# EasyEDA Pro project BaseBoard.epro

# Schematic Schematic1
Board Name: Board1; Create Date: 2025-06-30; Page Name: P1; Project Name: 推力矢量四轴机架; Schematic Name: Schematic1; Update Date: 2025-07-06; Company: 嘉立创EDA; Page Size: A4; Version: V1.0
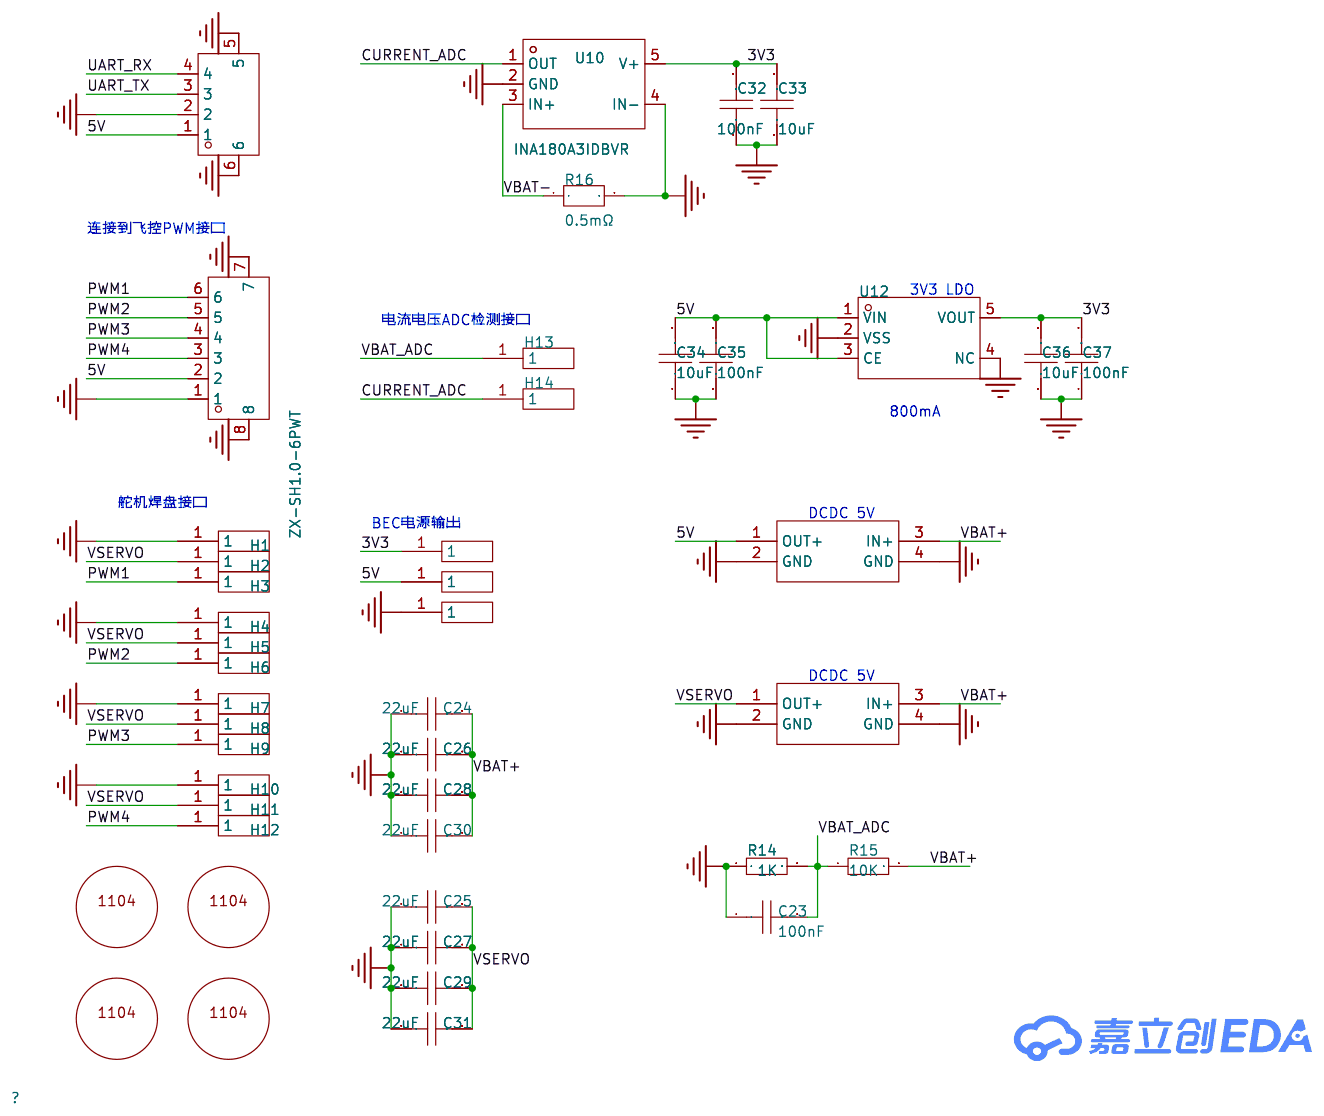
[diagram p0: schematic sheet]

## Parts
C23  100nF  [C0603]
C24  22uF  [C0805]
C25  22uF  [C0805]
C26  22uF  [C0805]
C27  22uF  [C0805]
C28  22uF  [C0805]
C29  22uF  [C0805]
C30  22uF  [C0805]
C31  22uF  [C0805]
C32  100nF  [C0603]
C33  10uF  [C0603]
C34  10uF  [C0603]
C35  100nF  [C0603]
C36  10uF  [C0603]
C37  100nF  [C0603]
H1  -  [飞控微型焊盘]
H2  -  [飞控微型焊盘]
H3  -  [飞控微型焊盘]
H4  -  [飞控微型焊盘]
H5  -  [飞控微型焊盘]
H6  -  [飞控微型焊盘]
H7  -  [飞控微型焊盘]
H8  -  [飞控微型焊盘]
H9  -  [飞控微型焊盘]
H10  -  [飞控微型焊盘]
H11  -  [飞控微型焊盘]
H12  -  [飞控微型焊盘]
H13  -  [飞控微型焊盘]
H14  -  [飞控微型焊盘]
H15  -  [飞控微型焊盘]
H17  -  [飞控微型焊盘]
H18  -  [飞控微型焊盘]
R14  1K  [R0603]
R15  10K  [R0603]
R16  0.5mΩ  [R2512]
U4  -  [1104无刷电机]
U5  -  [1104无刷电机]
U6  -  [1104无刷电机]
U7  -  [1104无刷电机]
U8  ZX-SH1.0-4PWT  [CONN-SMD_4P-P1.00_MEGASTAR_ZX-SH1.0-4PWT]
U10  INA180A3IDBVR  [SOT-23-5_L3.0-W1.7-P0.95-LS2.8-BR]
U11  ZX-SH1.0-6PWT  [CONN-SMD_6P-P1.00_MEGASTAR_ZX-SH1.0-6PWT]
U12  ME6217C33M5G  [SOT-23-5_L3.0-W1.7-P0.95-LS2.8-BR]
U13  -  [迷你降压模块]
U14  -  [迷你降压模块]

## Library data of the parts
C23 C32-C37 = CAP_0603: Supplier Footprint: 0603
C24-C31 = CAP_0805: Supplier Footprint: 0805
H1-H15 H17 H18 = 飞控微型焊盘: 20250513 绘制接收机使用
R14 R15 = Res_0603: Supplier Footprint: 0603
R16 = HoYLR2512E-3W-0.5mR-1%: 电阻类型:采样电阻;阻值:0.5mΩ;精度:±1%;功率:3W;安装方式:贴片;; LCSC Part Name: 0.5mΩ ±1% 3W; Supplier Part: C5375456; Manufacturer: Milliohm(毫欧); Supplier Footprint: 2512; JLCPCB Part Class: 扩展库; Supplier: LCSC; Type: 采样电阻; Tolerance: ±1%; Power(Watts): 3W; Mounting Sytle: 贴片
U4-U7 = 1104无刷电机
U8 = ZX-SH1.0-4PWT: 插针结构:1x4P;间距:1mm;安装方式:卧贴;参考系列:SH;总PIN数:4P;排数:1;每排PIN数:4;行距:-;额定电流:-;触头材质:黄铜;触头镀层:锡;工作温度范围:-;; LCSC Part Name: 1x4P 间距:1mm 卧贴 系列:SH; Supplier Part: C7430446; Manufacturer: Megastar(兆星); Supplier Footprint: SMD,P=1mm,卧贴; JLCPCB Part Class: 扩展库; Datasheet: https://atta.szlcsc.com/upload/public/pdf/source/20230619/390816C24B7A0EB1D042395C380CEA99.pdf; Supplier: LCSC; Pins Structure: 1x4P; Pitch: 1mm; Mounting Style: 卧贴; Reference Series: SH; Number of Pins: 4P; Number of Rows: 1; Number of PINs Per Row: 4; Contact Material: 黄铜; Contact Plating: 锡; Supplementary Features: 辅助焊脚; Colour: 米色; Z-Height of the Board: 3.15mm; X-Length of Bottom Edge on Board (Spacing Line): 6.35mm; Y-Width of Bottom Edge on Board: 5.05mm
U10 = INA180A3IDBVR: 放大器数:单路;共模电压:-200mV~26V;增益:100V/V;带宽:150kHz;; Supplier Part: C122882; Manufacturer: TI(德州仪器); Supplier Footprint: SOT-23-5; JLCPCB Part Class: 扩展库; Datasheet: https://www.ti.com/cn/lit/gpn/ina180; Supplier: LCSC; Number of Channels: 单路; Vcm - Common Mode Voltage: -200mV~26V; Gain: 100V/V; Bandwidth: 150kHz; Voltage - Supply: 2.7V~5.5V; Operating Temperature: -40℃~+125℃
U11 = ZX-SH1.0-6PWT: 插针结构:1x6P;间距:1mm;安装方式:卧贴;参考系列:SH;总PIN数:6P;排数:1;每排PIN数:6;行距:-;额定电流:-;触头材质:黄铜;触头镀层:锡;工作温度范围:-;; LCSC Part Name: 1x6P 间距:1mm 卧贴 系列:SH; Supplier Part: C7430448; Manufacturer: Megastar(兆星); Supplier Footprint: SMD,P=1mm,卧贴; JLCPCB Part Class: 扩展库; Datasheet: https://atta.szlcsc.com/upload/public/pdf/source/20230619/677B156B919545DC550B043554513491.pdf; Supplier: LCSC; Pins Structure: 1x6P; Pitch: 1mm; Mounting Style: 卧贴; Reference Series: SH; Number of Pins: 6P; Number of Rows: 1; Number of PINs Per Row: 6; Contact Material: 黄铜; Contact Plating: 锡; Supplementary Features: 辅助焊脚; Colour: 米色; Z-Height of the Board: 3.15mm; X-Length of Bottom Edge on Board (Spacing Line): 8.35mm; Y-Width of Bottom Edge on Board: 5.05mm
U12 = ME6217C33M5G: 输出类型:固定;输出极性:正;最大输入电压:7V;输出电压:3.3V;输出电流:800mA;电源纹波抑制比(PSRR):65dB@(1kHz);; Supplier Part: C427602; Manufacturer: MICRONE(南京微盟); Supplier Footprint: SOT-23-5; JLCPCB Part Class: 扩展库; Datasheet: https://atta.szlcsc.com/upload/public/pdf/source/20190910/C427602_D4B9162A2E9D9EF57C60010DFDECEF37.pdf; Supplier: LCSC; Output Type: 固定; Output Polarity: 正; Number of Outputs: 1; Maximum Input Voltage: 7V; Output Voltage: 3.3V; Dropout Voltage: 180mV@(300mA); Output Current: 800mA; Power Supply Rejection Ratio (PSRR): 65dB@(1kHz)
U13 U14 = 迷你DCDC降压模块: 20250630 DCDC 5V

## Nets
3V3: C32.2 C33.2 C36.2 C37.2 H15.1 U10.5(V+) U12.5(VOUT)
5V: C34.2 C35.2 H17.1 U8.1 U11.2 U12.1(VIN) U12.3(CE) U13.1(OUT+)
GND: C23.1 C24.1 C25.1 C26.1 C27.1 C28.1 C29.1 C30.1 C31.1 C32.1 C33.1 C34.1 C35.1 C36.1 C37.1 H1.1 H4.1 H7.1 H10.1 H18.1 R14.1 R16.2 U8.2 U8.5 U8.6 U10.2(GND) U10.4(IN-) U11.1 U11.7 U11.8 U12.2(VSS) U12.4(NC) U13.2(GND) U13.4(GND) U14.2(GND) U14.4(GND)
VBAT+: C24.2 C26.2 C28.2 C30.2 R15.2 U13.3(IN+) U14.3(IN+)
VBAT-: R16.1 U10.3(IN+)
VBAT_ADC: C23.2 H13.1 R14.2 R15.1
CURRENT_ADC: H14.1 U10.1(OUT)
PWM1: H3.1 U11.6
PWM2: H6.1 U11.5
PWM3: H9.1 U11.4
PWM4: H12.1 U11.3
UART_RX: U8.4
UART_TX: U8.3
VSERVO: C25.2 C27.2 C29.2 C31.2 H2.1 H5.1 H8.1 H11.1 U14.1(OUT+)

## Notes on the sheet
- 连接到飞控PWM接口
- 3V3 LDO
- 电流电压ADC检测接口
- 800mA
- 舵机焊盘接口
- DCDC 5V
- BEC电源输出
- DCDC 5V

# Board PCB1
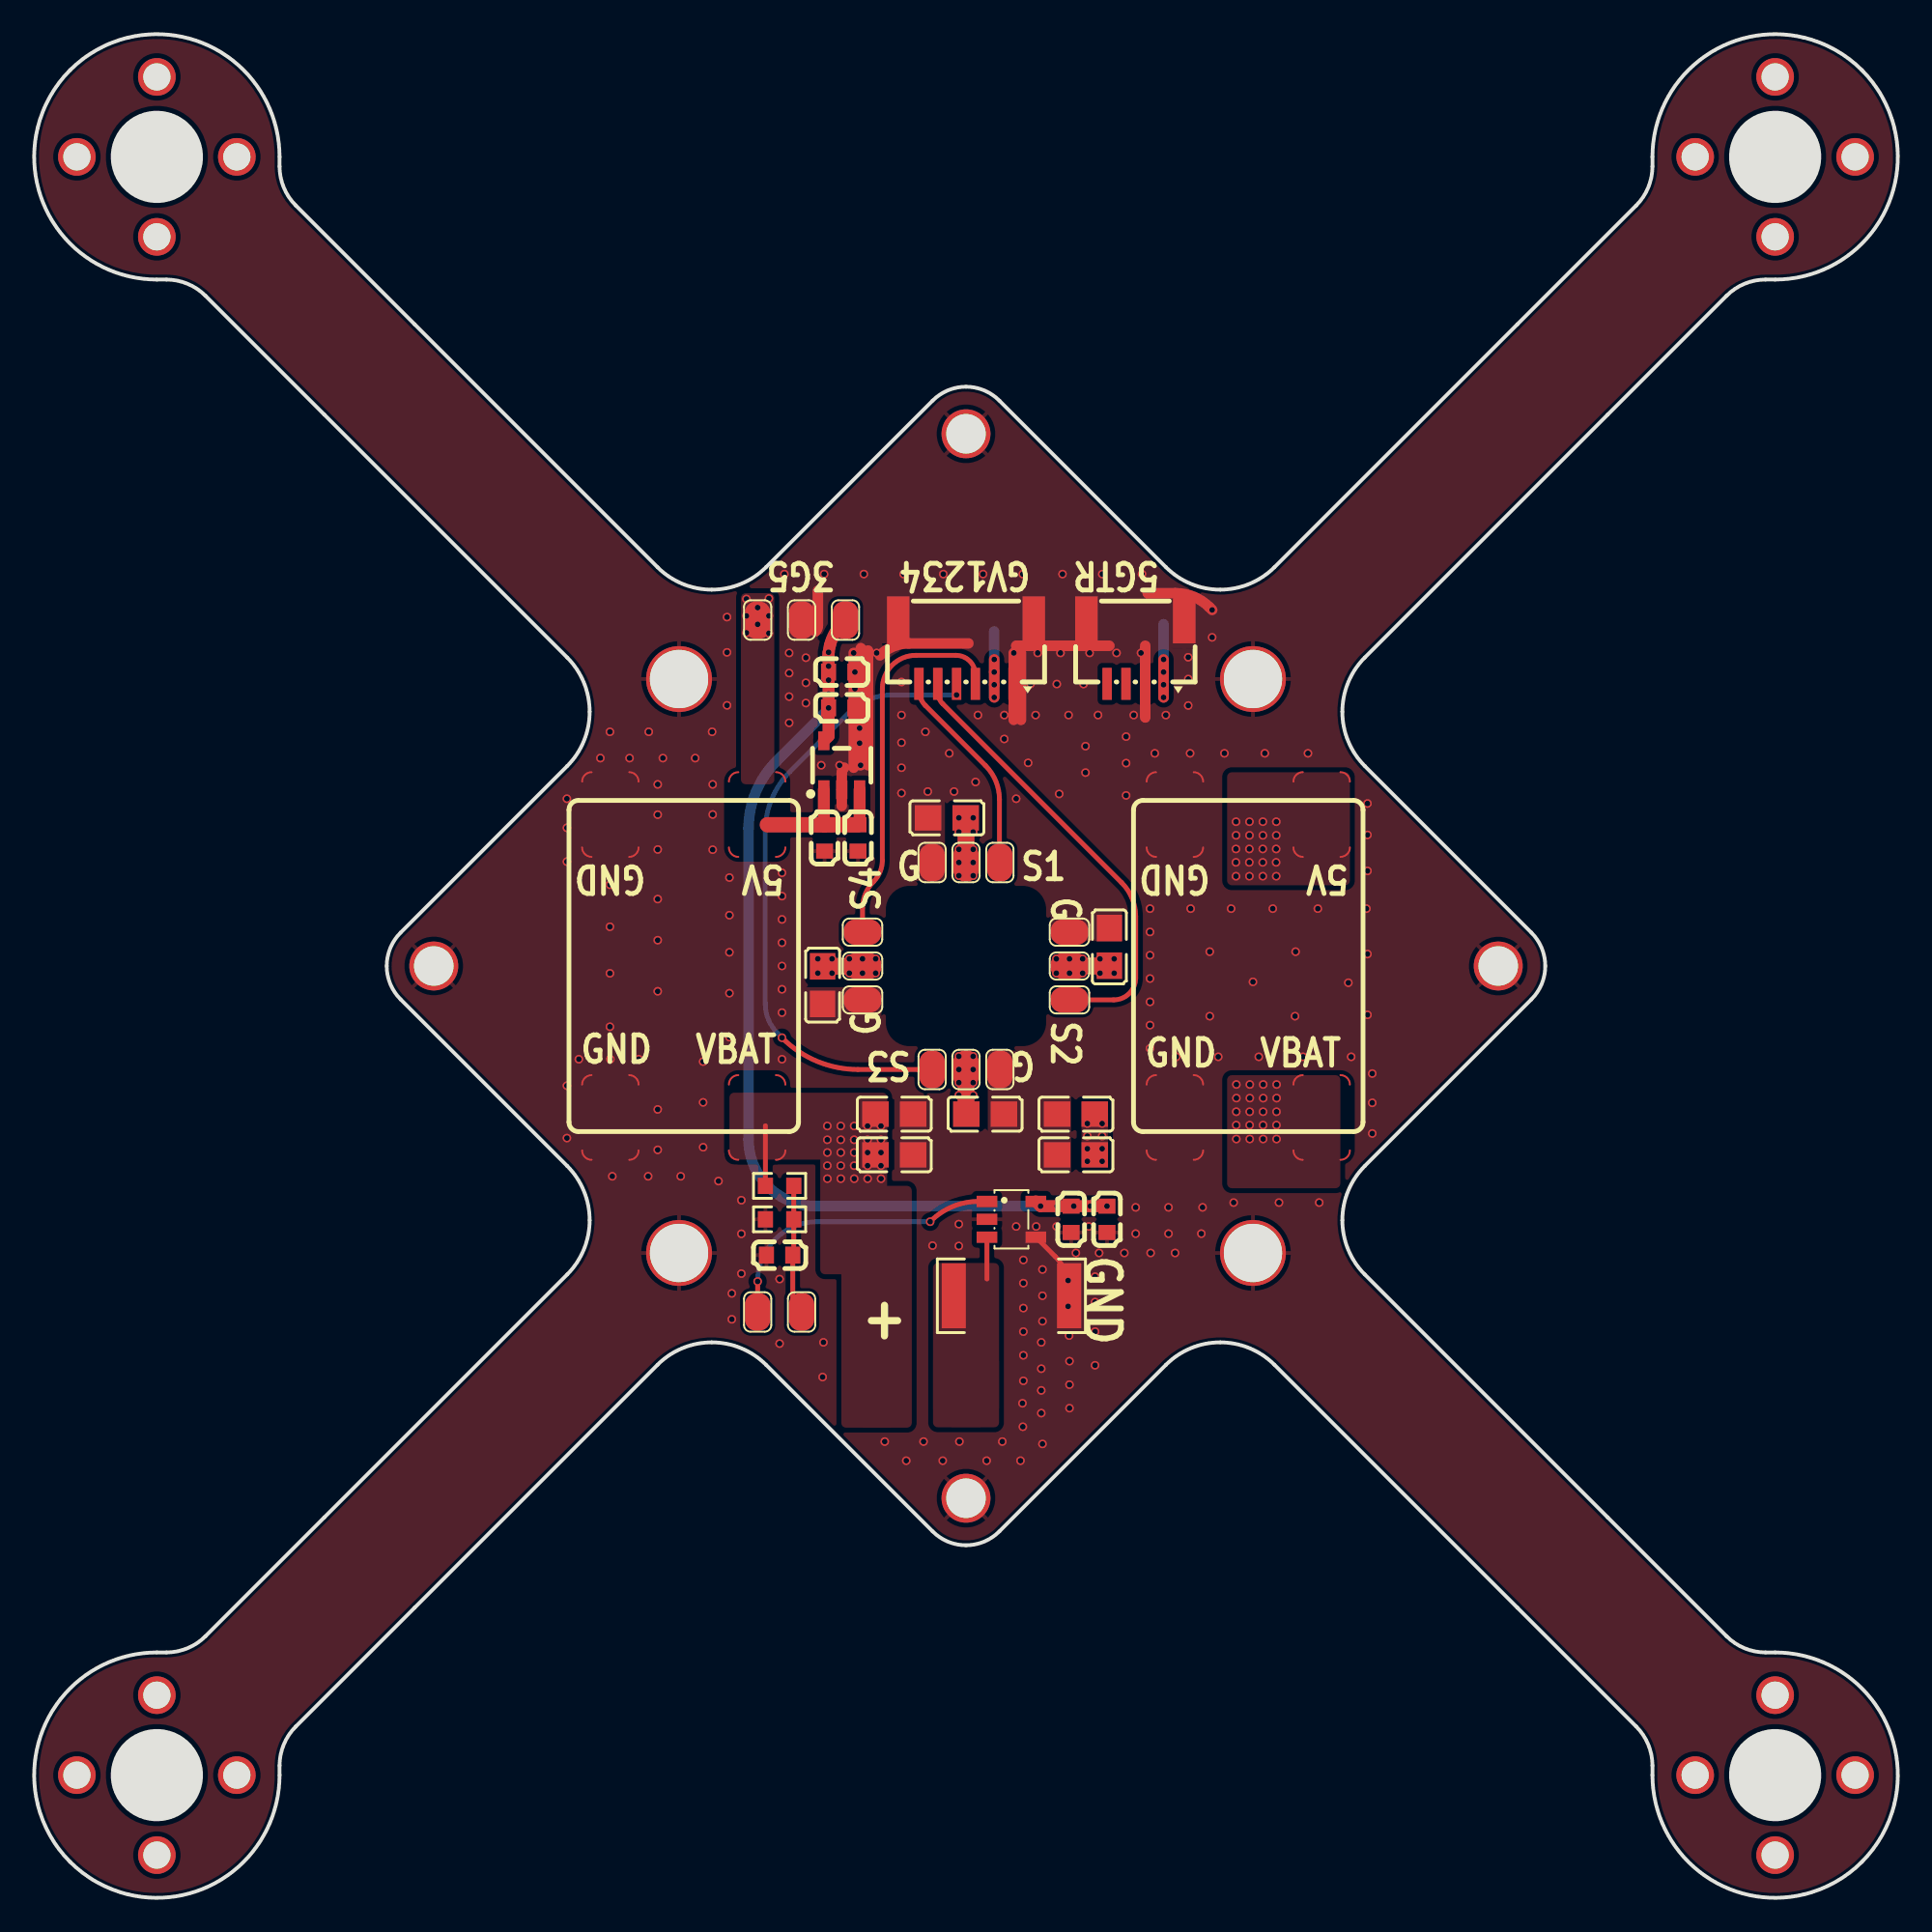
[diagram p1: board, top side]
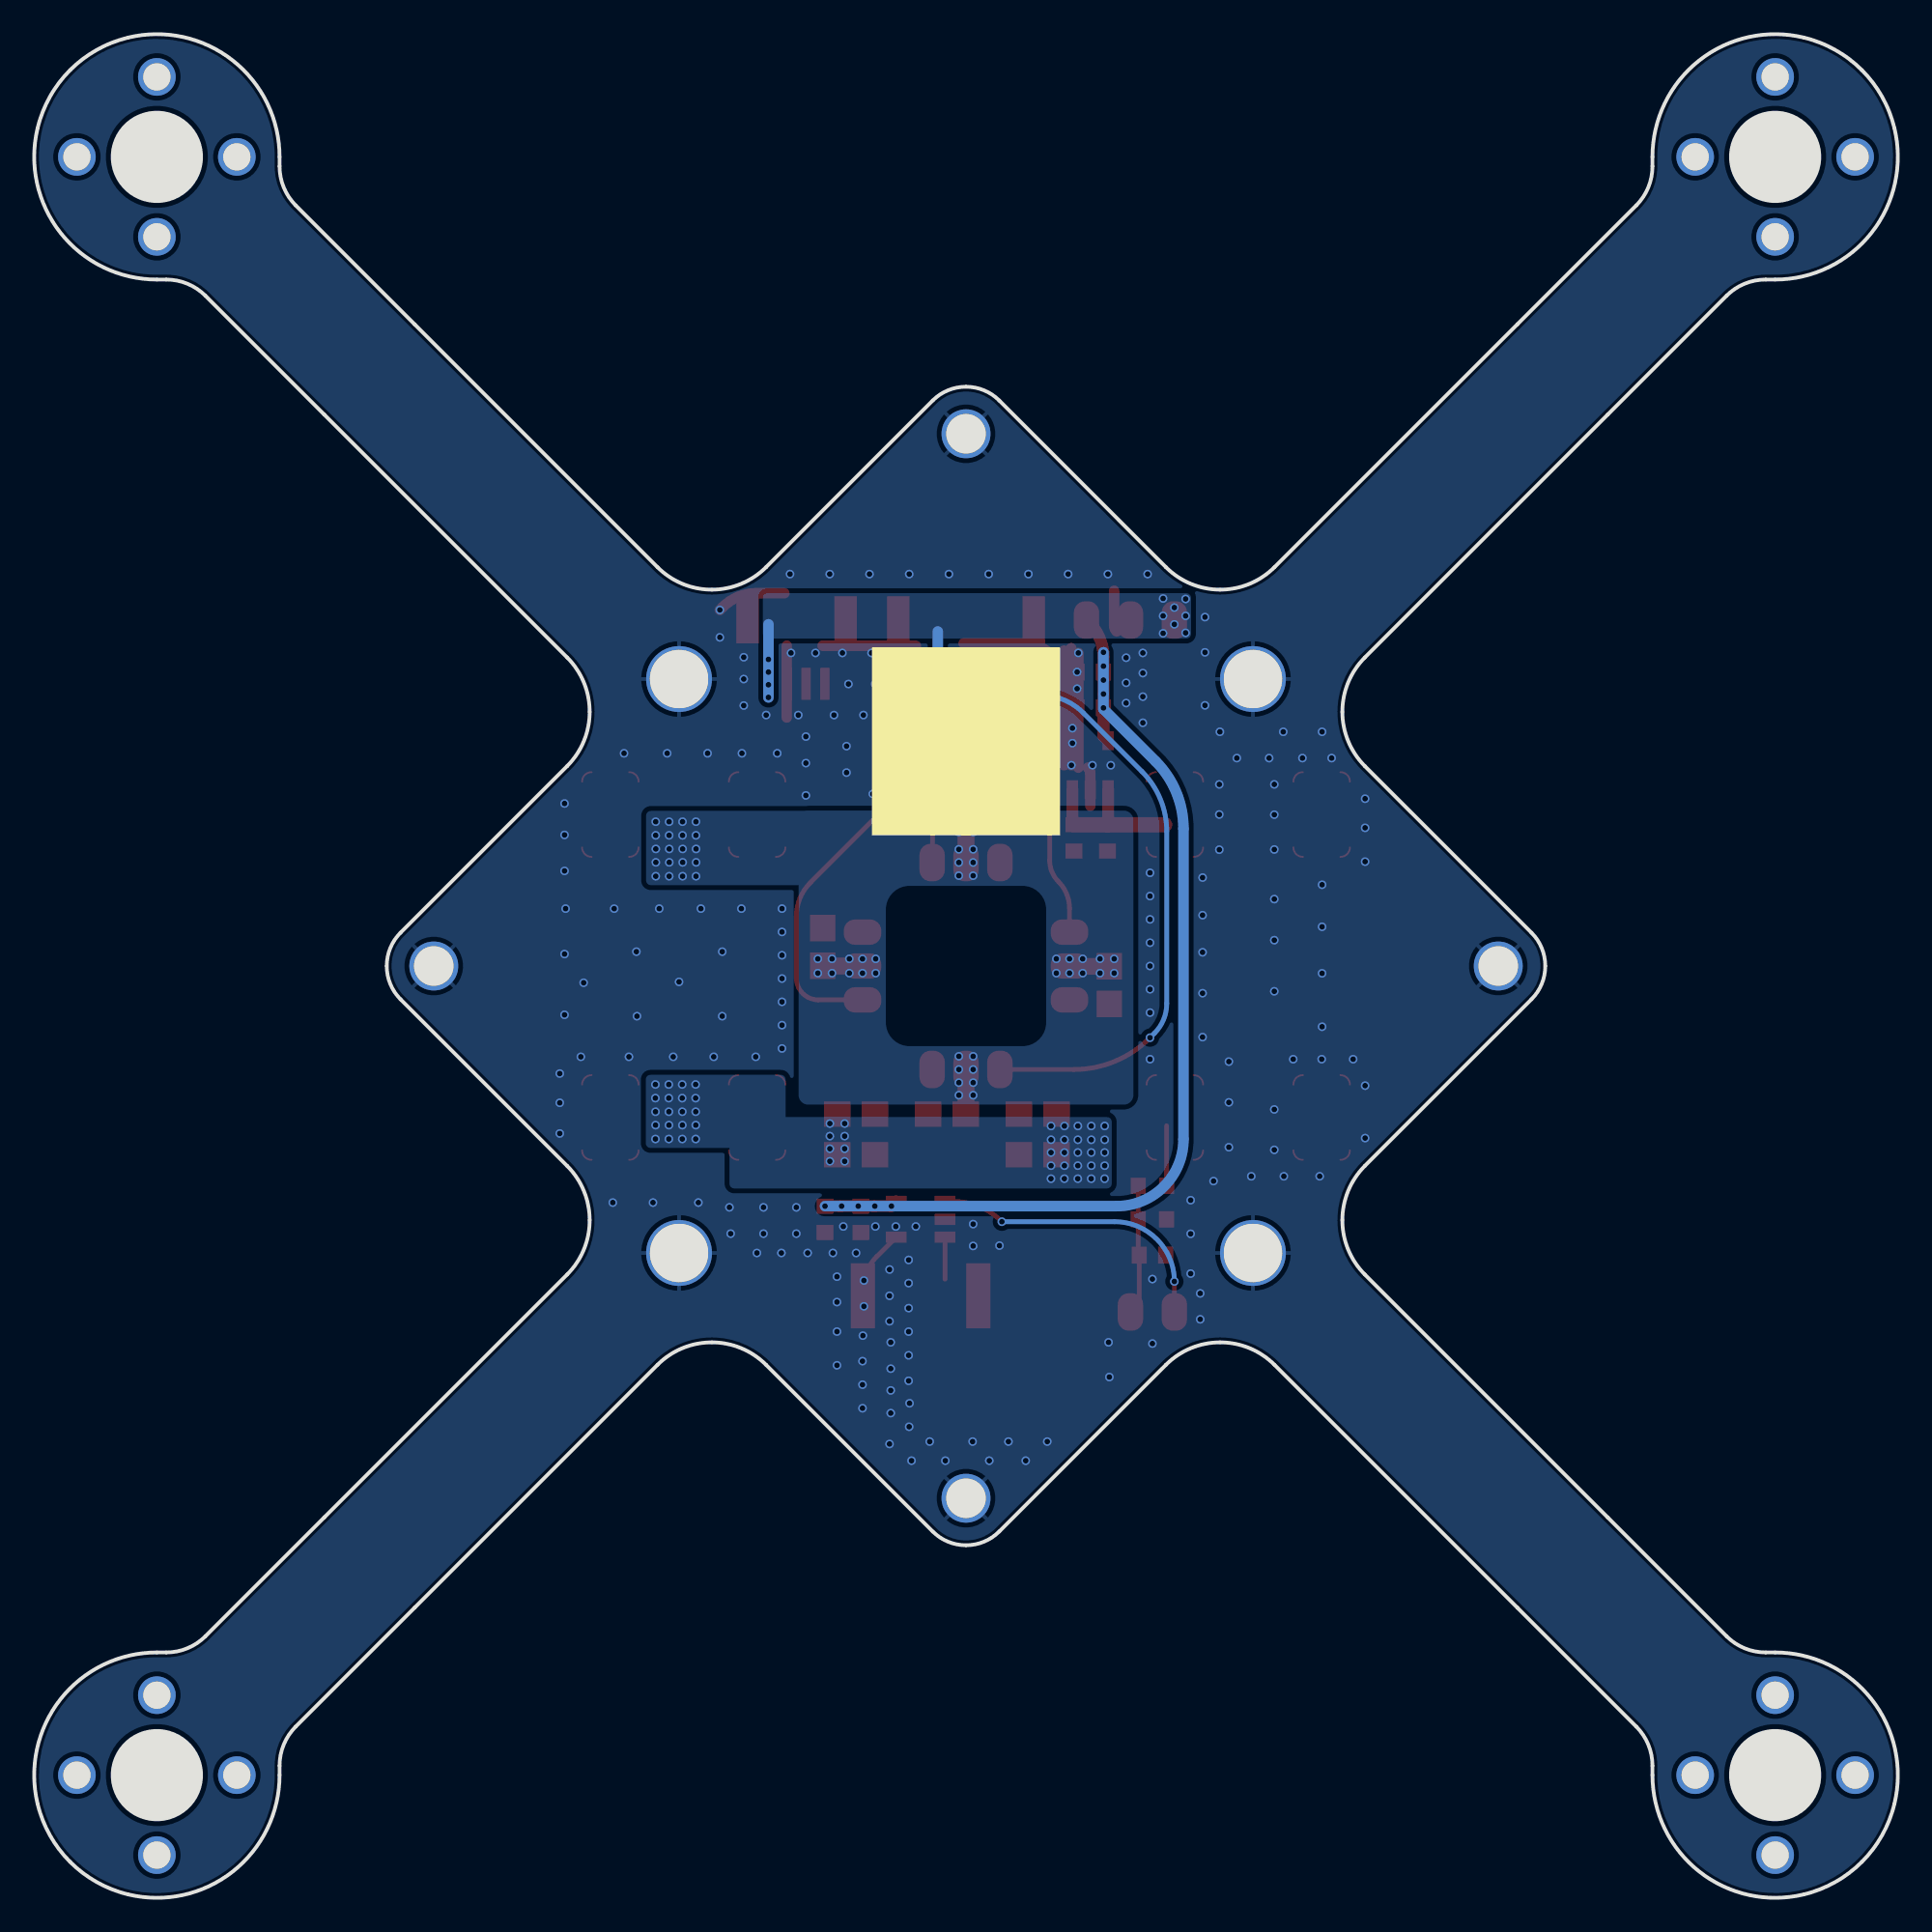
[diagram p2: board, bottom side, seen from below]

Outline 99.04 x 99.04 mm; copper layers: Top Layer, Bottom Layer. Coordinates in mm from the lower left corner of the outline.
Outline path: 0.18,94.06 arc(0.83,95.71) 1.91,97.13 arc(3.33,98.21) 4.98,98.86 arc(10.55,97.65) 13.04,92.52 13.04,92.02 arc(13.26,90.89) 13.9,89.94 33.13,70.72 arc(34.45,69.83) 36.01,69.52 arc(37.57,69.83) 38.9,70.72 47.75,79.57 arc(48.56,80.11) 49.52,80.3 arc(50.48,80.11) 51.29,79.57 60.14,70.72 arc(61.47,69.83) 63.03,69.52 arc(64.59,69.83) 65.92,70.72 85.14,89.94 arc(85.78,90.89) 86,92.02 86,92.52 arc(88.49,97.64) 94.06,98.86 arc(95.71,98.21) 97.13,97.13 arc(98.21,95.71) 98.86,94.06 arc(97.65,88.49) 92.52,86 92.02,86 arc(90.89,85.78) 89.94,85.14 70.72,65.92 arc(69.83,64.59) 69.52,63.03 arc(69.83,61.47) 70.72,60.14 79.57,51.29 arc(80.11,50.48) 80.3,49.52 arc(80.11,48.56) 79.57,47.75 70.72,38.9 arc(69.83,37.57) 69.52,36.01 arc(69.83,34.45) 70.72,33.13 89.94,13.9 arc(90.89,13.26) 92.02,13.04 92.52,13.04 arc(97.64,10.55) 98.86,4.98 arc(98.21,3.33) 97.13,1.91 arc(95.71,0.83) 94.06,0.18 arc(88.49,1.4) 86,6.52 86,7.02 arc(85.78,8.15) 85.14,9.1 65.92,28.33 arc(64.59,29.21) 63.03,29.52 arc(61.47,29.21) 60.14,28.33 51.29,19.47 arc(50.48,18.93) 49.52,18.74 arc(48.56,18.93) 47.75,19.47 38.9,28.33 arc(37.57,29.21) 36.01,29.52 arc(34.45,29.21) 33.13,28.33 13.9,9.1 arc(13.26,8.15) 13.04,7.02 13.04,6.52 arc(10.55,1.4) 4.98,0.18 arc(3.33,0.83) 1.91,1.91 arc(0.83,3.33) 0.18,4.98 arc(1.4,10.55) 6.52,13.04 7.02,13.04 arc(8.15,13.26) 9.1,13.9 28.33,33.13 arc(29.21,34.45) 29.52,36.01 arc(29.21,37.57) 28.33,38.9 19.47,47.75 arc(18.93,48.56) 18.74,49.52 arc(18.93,50.48) 19.47,51.29 28.33,60.14 arc(29.21,61.47) 29.52,63.03 arc(29.21,64.59) 28.33,65.92 9.1,85.14 arc(8.15,85.78) 7.02,86 6.52,86 arc(1.4,88.49) 0.18,94.06
Stack: Top Layer 0.035mm / Dielectric1 1.51mm FR4 er 4.5 / Bottom Layer 0.035mm

## Design rules (mm)
template: 自定义配置
spacing copperThickness1oz (default): track to track 0.102, other pairs 0.152 to 0.3
spacing copperThickness2oz: track to track 0.203, other pairs 0.152 to 0.3
track width copperThickness1oz (default): min 0.127, default 0.254, max 2.54
track width copperThickness2oz: min 0.203, default 0.254, max 2.54
differential pair differentialPair (default): width min 0.127, default 0.254, max 2.54; gap min 0.152, default 0.152
via viaSize (default): diameter min 0.254, default 0.457, max 10; hole min 0.3, default 0.305, max 6.299

## Placement (name value [footprint] x y rotation side)
C23  100nF  [C0603]  39.61 34.15 0 top
C24  22uF  [C0805]  45.71 39.49 180 top
C25  22uF  [C0805]  57.14 50.54 270 top
C26  22uF  [C0805]  45.71 41.65 180 top
C27  22uF  [C0805]  50.54 41.65 180 top
C28  22uF  [C0805]  55.36 41.65 0 top
C29  22uF  [C0805]  41.9 48.5 90 top
C30  22uF  [C0805]  55.36 39.49 0 top
C31  22uF  [C0805]  48.5 57.39 0 top
C32  100nF  [C0603]  55.11 36.06 90 top
C33  10uF  [C0603]  57.01 36.06 90 top
C34  10uF  [C0603]  43.78 56.33 90 top
C35  100nF  [C0603]  42 56.33 90 top
C36  10uF  [C0603]  42.92 65.14 180 top
C37  100nF  [C0603]  42.92 63.24 180 top
H1  -  [飞控微型焊盘]  47.72 55.02 90 top
H2  -  [飞控微型焊盘]  49.52 55.02 90 top
H3  -  [飞控微型焊盘]  51.32 55.02 90 top
H4  -  [飞控微型焊盘]  55.02 51.32 0 top
H5  -  [飞控微型焊盘]  55.02 49.52 0 top
H6  -  [飞控微型焊盘]  55.02 47.72 0 top
H7  -  [飞控微型焊盘]  51.32 44.02 270 top
H8  -  [飞控微型焊盘]  49.52 44.02 270 top
H9  -  [飞控微型焊盘]  47.72 44.02 270 top
H10  -  [飞控微型焊盘]  44.02 47.72 180 top
H11  -  [飞控微型焊盘]  44.02 49.52 180 top
H12  -  [飞控微型焊盘]  44.02 51.32 180 top
H13  -  [飞控微型焊盘]  40.78 31.14 90 top
H14  -  [飞控微型焊盘]  38.45 31.14 90 top
H15  -  [飞控微型焊盘]  43.12 67.91 90 top
H17  -  [飞控微型焊盘]  38.45 67.91 90 top
H18  -  [飞控微型焊盘]  40.78 67.91 90 top
NOREF  -  [Pad_e37]  21.23 49.52 45 top
NOREF#2  -  [Pad_e41]  49.52 21.23 45 top
NOREF#3  -  [Pad_e169]  64.77 64.77 0 top
NOREF#4  -  [Pad_e166]  34.27 64.77 0 top
NOREF#5  -  [Pad_e40]  77.8 49.52 45 top
NOREF#6  -  [Pad_e39]  49.52 77.8 45 top
NOREF#7  -  [Pad_e171]  34.27 34.27 0 top
NOREF#8  -  [Pad_e170]  64.77 34.27 0 top
R14  1K  [R0603]  39.61 36.06 0 top
R15  10K  [R0603]  39.61 37.84 180 top
R16  0.5mΩ  [R2512]  51.93 31.99 0 top
U4  -  [1104无刷电机]  6.52 92.52 45 top
U5  -  [1104无刷电机]  92.52 92.52 45 top
U6  -  [1104无刷电机]  6.52 6.52 45 top
U7  -  [1104无刷电机]  92.52 6.52 45 top
U8  ZX-SH1.0-4PWT  [CONN-SMD_4P-P1.00_MEGASTAR_ZX-SH1.0-4PWT]  58.52 66.22 180 top
U10  INA180A3IDBVR  [SOT-23-5_L3.0-W1.7-P0.95-LS2.8-BR]  51.93 36.06 180 top
U11  ZX-SH1.0-6PWT  [CONN-SMD_6P-P1.00_MEGASTAR_ZX-SH1.0-6PWT]  49.52 66.22 180 top
U12  ME6217C33M5G  [SOT-23-5_L3.0-W1.7-P0.95-LS2.8-BR#2]  42.92 60.19 270 top
U13  -  [迷你降压模块]  34.52 49.52 270 top
U14  -  [迷你降压模块]  64.52 49.52 270 top
U15  -  [JLC-QRCODE-10x10]  49.52 61.46 180 bottom

## Footprints (pads in the part's own frame, mm; a bottom-side part is the same pattern mirrored in y, then rotated)
1104无刷电机
  round 2 hole 1.45: 1(-3.005,3.005) 2(3.005,3.005) 3(3.005,-3.005) 4(-3.005,-3.005)
C0603
  rect 0.8x0.9 smd: 1(-0.7,0) 2(0.7,0)
C0805
  rect 1.41x1.35 smd: 1(-1,0) 2(1,0)
CONN-SMD_4P-P1.00_MEGASTAR_ZX-SH1.0-4PWT
  rect 0.5x1.7 smd: 1(-1.5,1.7) 2(-0.5,1.7) 3(0.5,1.7) 4(1.5,1.7)
  rect 1.2x2.5 smd: 5(2.6,-1.7) 6(-2.6,-1.7)
CONN-SMD_6P-P1.00_MEGASTAR_ZX-SH1.0-6PWT
  rect 0.5x1.7 smd: 1(-2.5,1.7) 2(-1.5,1.7) 3(-0.5,1.7) 4(0.5,1.7) 5(1.5,1.7) 6(2.5,1.7)
  rect 1.2x2.5 smd: 7(3.6,-1.7) 8(-3.6,-1.7)
Pad_e37
  round 2.6 hole 2.1: 1(0,0)
Pad_e39
  round 2.6 hole 2.1: 1(0,0)
Pad_e40
  round 2.6 hole 2.1: 1(0,0)
Pad_e41
  round 2.6 hole 2.1: 1(0,0)
Pad_e166
  round 3.5 hole 3.1: 1(0,0)
Pad_e169
  round 3.5 hole 3.1: 1(0,0)
Pad_e170
  round 3.5 hole 3.1: 1(0,0)
Pad_e171
  round 3.5 hole 3.1: 1(0,0)
R0603
  rect 0.806x0.864 smd: 1(-0.753,0) 2(0.753,0)
R2512
  rect 1.282x3.456 smd: 1(-3.067,0) 2(3.067,0)
SOT-23-5_L3.0-W1.7-P0.95-LS2.8-BR
  rect 1.1x0.6 smd: 1(1.3,-0.95) 2(1.3,0) 3(1.3,0.95) 4(-1.3,0.95) 5(-1.3,-0.95)
SOT-23-5_L3.0-W1.7-P0.95-LS2.8-BR#2
  rect 1x0.6 smd: 1(1.3,-0.95) 2(1.3,0) 3(1.3,0.95) 4(-1.3,0.95) 5(-1.3,-0.95)
迷你降压模块
  custom 4.5x3 smd: 1(-8.05,3.9) 2(-8.05,-3.9) 3(8.05,3.9) 4(8.05,-3.9)
飞控微型焊盘
  rrect 2x1.35 smd: 1(0,0)

## Nets
As in the schematic, except:
GND: C23.1 C24.1 C25.1 C26.1 C27.1 C28.1 C29.1 C30.1 C31.1 C32.1 C33.1 C34.1 C35.1 C36.1 C37.1 H1.1 H4.1 H7.1 H10.1 H18.1 NOREF.1 NOREF#2.1 NOREF#3.1 NOREF#4.1 NOREF#5.1 NOREF#6.1 NOREF#7.1 NOREF#8.1 R14.1 R16.2 U8.2 U8.5 U8.6 U10.2 U10.4 U11.1 U11.7 U11.8 U12.2 U12.4 U13.2 U13.4 U14.2 U14.4

Pads without a net: U4 1 2 3 4; U5 1 2 3 4; U6 1 2 3 4; U7 1 2 3 4

## Via types
v1: diameter 0.457, hole 0.305, Top Layer to Bottom Layer, 360 vias

## Routing (per net, layer and track width the routed paths; a pad name or vN(x,y) marks a point on that pad's centre or on a via; arc(x,y) is an arc through that point)
3V3: length 59.4
  Top Layer w0.635: v1(42.21,66.19) 42.21,65.95 ; 42.21,65.95 v1(42.21,65.45) v1(42.21,64.71) v1(42.21,63.23) 42.21,61.73 U12.5 ; 42.21,65.95 arc(42.22,66.07) 42.22,66.19 arc(42.25,66.36) 42.28,66.54 arc(42.54,67.19) 42.96,67.75 H15.1 ; 53.23,37 v1(53.48,36.75) C32.2 v1(57.01,36.75)
  Bottom Layer w0.559: v1(42.21,66.19) v1(42.21,65.45) v1(42.21,64.71) v1(42.21,63.97) 42.21,63.17 39.44,60.4 arc(38.35,58.75) 37.96,56.82 37.96,40.31 arc(39,37.8) 41.52,36.75 v1(53.48,36.75) v1(54.36,36.75) v1(55.24,36.75) v1(56.13,36.75) v1(57.01,36.75)
5V: length 20
  Top Layer w0.559: v1(51.02,65.81) v1(51.02,65.14) v1(51.02,64.46) v1(51.02,63.79) ; v1(60.02,63.79) v1(60.02,64.46) v1(60.02,65.14) v1(60.02,65.81)
  Top Layer w0.635: C35.2 41.96,57.06 U12.1 ; C34.2 43.86,57.11 U12.3
  Top Layer w0.813: C34.2 C35.2 38.96,57.02
  Bottom Layer w0.559: v1(60.02,63.79) v1(60.02,64.46) v1(60.02,65.14) v1(60.02,65.81) 60.02,67.68 ; 51.02,67.3 v1(51.02,65.81) v1(51.02,65.14) v1(51.02,64.46) v1(51.02,63.79)
  vias: v1(37.85,69.03) v1(37.85,68.13) v1(37.85,67.23) v1(38.45,68.57) v1(38.45,67.68) v1(39.05,69.05) v1(39.05,68.13) v1(39.05,67.2)
GND: length 50.8
  Top Layer w0.254: 53.23,35.11 54.26,34.09 arc(54.69,33.5) v1(54.95,32.81) arc(54.99,32.55) 55,32.29 R16.2
  Top Layer w0.559: 59.17,69.33 60.66,69.33 arc(61.63,69.14) 62.45,68.58 v1(62.6,68.44) ; 44.31,66.28 44.31,60.18 ; 41.64,69.46 41.64,67.6 arc(41.61,67.44) 41.52,67.3 ; 43.55,60.06 v1(43.55,66.15) ; 42.91,58.03 U12.2 42.91,59.75 arc(42.94,59.89) 43.01,60.02 arc(43.02,60.04) 43.04,60.06 ; 43.93,66.41 43.93,60.21 arc(43.93,60.2) v1(43.92,60.18) ; 49.64,66.66 46.48,66.66 arc(45.65,66.5) 44.94,66.03 ; 52.18,66.53 57.14,66.53 ; 59.04,66.53 59.04,62.72 ; v1(52.06,66.15) 52.06,62.6 ; 52.44,66.15 52.44,62.6
  vias: v1(28.31,58.41) v1(28.31,56.86) v1(28.31,55.07) v1(28.31,43.16) v1(28.31,40.38) v1(28.95,44.57) v1(30.09,60.57) v1(30.6,61.97) v1(30.6,53.84) v1(30.6,51.61) v1(30.6,49.13) v1(30.6,46.29) v1(30.62,44.57) v1(30.72,38.34) v1(31.64,60.57) v1(32.13,44.57) v1(32.66,61.97) v1(32.63,38.34) v1(33.14,59.17) v1(33.14,57.56) v1(33.14,55.71) v1(33.14,53.08) v1(33.14,50.89) v1(33.14,48.18) v1(33.14,41.9) v1(33.14,39.75) v1(33.41,60.57) v1(34.36,38.34) v1(35.13,60.57) v1(35.55,44.44) v1(35.55,42.27) v1(35.55,39.89) v1(36.03,61.97) v1(36.06,59.17) v1(36.06,57.57) v1(36.06,55.7) v1(36.37,38.09) v1(36.82,68.06) v1(36.82,66.19) v1(36.82,63.37) v1(36.95,54.22) v1(36.95,52.22) v1(36.95,50.25) v1(36.95,48.08) v1(36.95,45.74) v1(37.07,32.12) v1(37.07,30.74) v1(37.58,37.07) v1(37.58,35.29) v1(37.58,33.17) v1(39.61,32.88) v1(39.61,29.45) v1(39.74,54.47) v1(39.74,53.23) v1(39.74,52) v1(39.74,50.76) v1(39.74,49.52) v1(39.74,48.28) v1(39.74,47.04) v1(39.74,44.57) v1(39.87,70.35) v1(40.12,66.16) v1(40.12,65.09) v1(40.12,63.84) v1(40.12,62.45) v1(41.01,65.9) v1(41.01,64.57) v1(41.01,63.49) v1(41.83,60.19) v1(41.94,29.52) v1(41.9,27.68) v1(41.98,70.35) v1(42.8,60.19) v1(43.62,65.14) v1(43.62,64.26) v1(43.87,62.16) v1(43.87,61.36) v1(44.09,70.35) v1(44.77,66.16) v1(45.2,24.25) v1(46.09,64.62) v1(46.09,62.86) v1(46.09,61.39) v1(46.09,60.06) v1(46.09,58.71) v1(46.2,70.35) v1(46.35,23.23) v1(47.26,24.25) v1(47.36,61.97) v1(47.49,58.79) v1(47.74,34.66) v1(48.31,70.35) v1(48.28,23.23) v1(48.63,60.82) v1(48.89,58.79) v1(49.14,35.8) v1(49.14,34.64) v1(49.17,24.25) v1(50.03,59.3) v1(50.16,62.86) v1(50.43,70.35) v1(50.62,23.23) v1(51.45,24.25) v1(51.56,62.86) v1(51.55,61.59) v1(52.19,58.41) v1(52.19,35.68) v1(52.42,23.23) v1(52.54,70.35) v1(52.57,33.9) v1(52.57,32.67) v1(52.57,31.34) v1(52.57,30.09) v1(52.57,28.83) v1(52.57,27.48) v1(52.52,26.28) v1(52.54,25.03) v1(52.82,60.32) v1(52.95,64.51) v1(53.22,62.86) v1(53.25,35.68) v1(53.33,66.16) v1(53.52,29.52) v1(53.52,28.12) v1(53.52,26.97) v1(53.52,25.76) v1(53.58,33.39) v1(53.58,31.99) v1(53.58,30.64) v1(53.58,24.12) v1(54.35,64.51) v1(54.34,35.68) v1(54.54,66.16) v1(54.47,58.66) v1(54.65,70.35) v1(54.95,31.43) v1(54.97,62.86) v1(55,29.88) v1(55.02,28.52) v1(55.02,27.27) v1(55.02,26.02) v1(55.36,34.27) v1(55.77,64.51) v1(55.87,61.2) v1(55.87,59.8) v1(56.04,35.68) v1(56.09,66.16) v1(56.38,33.01) v1(56.38,31.66) v1(56.38,30.09) v1(56.38,28.3) v1(56.54,62.86) v1(56.59,34.27) v1(56.76,70.35) v1(57.52,66.16) v1(57.94,34.27) v1(58.03,61.71) v1(58.03,60.3) v1(58.03,58.59) v1(58.43,62.86) v1(58.54,36.69) v1(58.54,35.3) v1(58.82,66.16) v1(58.87,70.35) v1(59.3,52.57) v1(59.3,51.33) v1(59.3,50.09) v1(59.3,48.85) v1(59.3,47.61) v1(59.3,46.38) v1(59.3,45.14) v1(59.33,34.27) v1(59.55,60.82) v1(60.14,62.86) v1(60.28,36.69) v1(60.28,35.3) v1(60.63,34.27) v1(60.7,44.69) v1(61.33,65.93) v1(61.33,64.77) v1(61.33,63.36) v1(61.43,60.82) v1(61.46,52.57) v1(62.03,35.3) v1(62.09,36.69) v1(62.47,50.28) v1(62.47,46.85) v1(62.6,66.99) v1(62.93,44.69) v1(63.25,60.82) v1(63.61,52.57) v1(63.74,36.95) v1(64.77,48.68) v1(65.08,44.69) v1(65.4,60.82) v1(65.82,52.57) v1(66.15,36.95) v1(67.04,50.28) v1(67.01,46.85) v1(67.43,44.69) v1(67.69,60.82) v1(68.22,52.57) v1(68.29,36.95) v1(69.84,48.63) v1(69.99,44.69) v1(70.86,58.16) v1(70.86,56.49) v1(70.86,54.57) v1(70.8,52.57) v1(70.86,50.16) v1(70.86,46.93) v1(71.11,43.81) v1(71.11,42.25) v1(71.11,40.62)
VBAT+: length 3.2
  Top Layer w0.254: R15.2 38.86,41.03
  vias: v1(42.15,41.02) v1(42.15,40.29) v1(42.15,39.61) v1(42.15,38.91) v1(42.15,38.22) v1(42.86,41.02) v1(42.86,40.29) v1(42.86,39.61) v1(42.86,38.91) v1(42.87,38.22) v1(43.58,41.02) v1(43.58,40.29) v1(43.58,39.61) v1(43.58,38.91) v1(43.58,38.22) v1(44.29,41.02) v1(44.29,40.29) v1(44.29,39.61) v1(44.29,38.91) v1(44.29,38.22) v1(45,41.02) v1(45,40.29) v1(45,39.61) v1(45,38.91) v1(45.01,38.22) v1(55.97,41.15) v1(55.97,40.48) v1(55.97,39.81) v1(55.97,39.14) v1(56.76,41.15) v1(56.76,40.48) v1(56.76,39.81) v1(56.76,39.14) v1(63.89,43.22) v1(63.89,42.5) v1(63.88,41.78) v1(63.88,41.06) v1(63.89,40.33) v1(64.6,43.22) v1(64.6,42.5) v1(64.6,41.78) v1(64.59,41.06) v1(64.6,40.33) v1(65.32,43.22) v1(65.32,42.5) v1(65.31,41.78) v1(65.31,41.06) v1(65.31,40.33) v1(66.03,43.22) v1(66.03,42.5) v1(66.02,41.78) v1(66.02,41.06) v1(66.02,40.33)
VBAT-: length 2.2
  Top Layer w0.254: U10.3 50.63,32.88
VBAT_ADC: length 6.9
  Top Layer w0.254: H13.1 40.31,31.6 C23.2 40.36,34.2 R14.2 R15.1
CURRENT_ADC: length 15.9
  Top Layer w0.254: U10.1 50.17,37 arc(48.8,36.73) 47.64,35.95 v1(47.61,35.93) ; H14.1 v1(38.44,32.75)
  Bottom Layer w0.254: v1(47.62,35.93) 41.62,35.93 arc(39.38,35) v1(38.45,32.76)
PWM1: length 11.1
  Top Layer w0.254: 47.02,64.52 47.02,64.2 arc(47.11,63.74) 47.37,63.36 50.55,60.17 arc(51.1,59.35) 51.3,58.37 51.3,55.04 H3.1
PWM2: length 24
  Top Layer w0.254: H6.1 57.37,47.72 arc(58.19,48.06) 58.53,48.88 58.53,52.15 arc(58.34,53.12) 57.79,53.94 48.27,63.46 arc(48.08,63.74) 48.02,64.08 48.02,64.51
PWM3: length 33.6
  Top Layer w0.254: H9.1 43.78,44.02 arc(41.61,44.45) 39.76,45.68 v1(39.74,45.71)
  Bottom Layer w0.254: v1(39.74,45.71) 39.51,45.95 arc(39.02,46.67) 38.85,47.52 38.85,56.67 arc(39.2,58.4) 40.17,59.86 43.28,62.96 arc(44.34,63.67) 45.6,63.92 v1(49.02,63.92)
PWM4: length 20.2
  Top Layer w0.254: H12.1 44.02,52.58 arc(44.17,53.35) 44.6,54 arc(44.95,54.52) 45.07,55.13 45.07,64.25 arc(45.59,65.51) 46.85,66.03 48.98,66.03 arc(49.71,65.72) 50.02,64.99 50.02,64.51
VSERVO: length 9
  Top Layer w0.889: C27.2 49.52,41.66 H8.1 ; C25.2 57.12,49.52 H5.1 ; C29.2 44,49.5 H11.1 ; H2.1 49.52,57.37 C31.2
  vias: v1(41.65,49.9) v1(41.65,49.14) v1(42.4,49.9) v1(42.4,49.14) v1(43.32,49.9) v1(43.32,49.14) v1(44.02,49.9) v1(44.02,49.14) v1(44.72,49.9) v1(44.72,49.14) v1(49.14,57.39) v1(49.14,56.64) v1(49.14,55.72) v1(49.14,55.02) v1(49.14,54.32) v1(49.14,44.72) v1(49.14,44.02) v1(49.14,43.32) v1(49.14,42.65) v1(49.9,57.39) v1(49.9,56.64) v1(49.9,55.72) v1(49.9,55.02) v1(49.9,54.32) v1(49.9,44.72) v1(49.9,44.02) v1(49.9,43.32) v1(49.9,42.65) v1(54.32,49.9) v1(54.32,49.14) v1(55.02,49.9) v1(55.02,49.14) v1(55.72,49.9) v1(55.72,49.14) v1(56.64,49.9) v1(56.64,49.14) v1(57.39,49.9) v1(57.39,49.14) v1(63.87,55.74) v1(63.86,55.03) v1(63.87,54.29) v1(63.87,57.19) v1(63.87,56.46) v1(64.59,57.19) v1(64.59,56.46) v1(64.58,55.74) v1(64.58,55.03) v1(64.58,54.29) v1(65.3,57.19) v1(65.3,56.46) v1(65.29,55.74) v1(65.29,55.03) v1(65.29,54.29) v1(66.01,57.19) v1(66.01,56.46) v1(66,55.74) v1(66,55.03) v1(66.01,54.29)

## Copper pours and planes (outline as drawn; the poured copper is in the pictures)
5V on Top Layer: 37.56,69.34 39.34,69.34 39.34,59.18 37.56,59.18
5V on Bottom Layer: 37.56,69.34 60.32,69.34 60.32,66.92 37.56,66.92
GND on Top Layer: 28.82,40.63 33.14,40.63 33.14,38.73 28.82,38.73
GND on Top Layer: 28.42,45.27 33.14,45.27 33.14,39.61 28.42,39.61
GND on Top Layer: -7.12,106.04 106.8,106.04 106.8,-7.38 -7.12,-7.38
GND on Top Layer: 52.19,36.06 54.18,36.06 54.18,31.99 52.19,31.99
GND on Top Layer: 45.71,42.61 48.02,42.61 48.02,38.39 45.71,38.39
GND on Top Layer: 52.52,29.52 56.02,29.52 56.02,25.02 52.52,25.02
GND on Top Layer: 58.16,44.95 62.82,44.95 62.82,38.28 58.16,38.28
GND on Top Layer: 54.01,52.86 57.81,52.86 57.81,50.84 54.01,50.84
GND on Top Layer: 44.57,69.97 57.45,69.97 57.45,66.67 44.57,66.67
GND on Top Layer: 53.2,43.3 55.11,43.3 55.11,38.22 53.2,38.22
GND on Top Layer: 28.69,60.19 33.26,60.19 33.26,54.22 28.69,54.22
GND on Top Layer: 46.06,58.95 48.4,58.95 48.4,54.03 46.06,54.03
GND on Top Layer: 57.78,61.46 62.86,61.46 62.86,54.73 57.78,54.73
GND on Top Layer: 40.18,48.39 45.02,48.39 45.02,46.42 40.18,46.42
GND on Top Layer: 50.68,45.02 52.95,45.02 52.95,39.87 50.68,39.87
GND on Top Layer: 59.72,69.04 63.11,69.04 63.11,66.41 59.72,66.41
GND on Top Layer: 53.47,34.27 56.63,34.27 56.63,29.71 53.47,29.71
GND on Top Layer: 39.72,69.52 41.65,69.52 41.65,66.54 39.72,66.54
GND on Bottom Layer: -8.01,105.27 108.45,105.27 108.45,-7.88 -8.01,-7.88
VBAT+ on Top Layer: 43.02,29.52 46.52,29.52 46.52,25.02 43.02,25.02
VBAT+ on Top Layer: 41.77,39.61 45.33,39.61 45.33,33.14 41.77,33.14
VBAT+ on Top Layer: 36.95,42.79 45.34,42.79 45.34,39.23 36.95,39.23
VBAT+ on Top Layer: 42.89,37.84 46.64,37.84 46.64,24.98 42.89,24.98
VBAT+ on Top Layer: 55.66,41.94 57.07,41.94 57.07,39.13 55.66,39.13
VBAT+ on Top Layer: 63.4,43.72 69.41,43.72 69.41,37.71 63.4,37.71
VBAT+ on Bottom Layer: 59.11,43.74 66.54,43.74 66.54,39.85 59.11,39.85
VBAT+ on Bottom Layer: 41.77,41.49 62.09,41.49 62.09,37.7 41.77,37.7
VBAT- on Top Layer: 47.77,33.74 51.28,33.74 51.28,25 47.77,25
VBAT- on Top Layer: 47.77,29.52 51.27,29.52 51.27,25.02 47.77,25.02
VSERVO on Top Layer: 63.4,59.82 69.92,59.82 69.92,53.81 63.4,53.81
VSERVO on Bottom Layer: 53.48,57.76 66.52,57.76 66.52,53.81 53.48,53.81
VSERVO on Bottom Layer: 40.62,57.27 40.63,57.38 40.68,57.51 40.77,57.63 40.89,57.71 41.02,57.76 41.13,57.78 57.91,57.78 58.02,57.76 58.15,57.71 58.27,57.63 58.36,57.51 58.41,57.38 58.42,57.27 58.42,42.66 58.41,42.55 58.36,42.42 58.27,42.3 58.15,42.22 58.02,42.17 57.91,42.15 41.13,42.15 41.02,42.17 40.89,42.22 40.77,42.3 40.68,42.42 40.63,42.55 40.62,42.66

## Text on the board
Document Layer: 3 | 4 | 1 | 2 | +-
Top Silkscreen Layer: 3G5 | GV1234 | 5GTR | S1 | S4 | S2 | GND | VBAT | G | S3 | 5V | +
